# EAGLE design M218X (EAGLE 6.6.0)
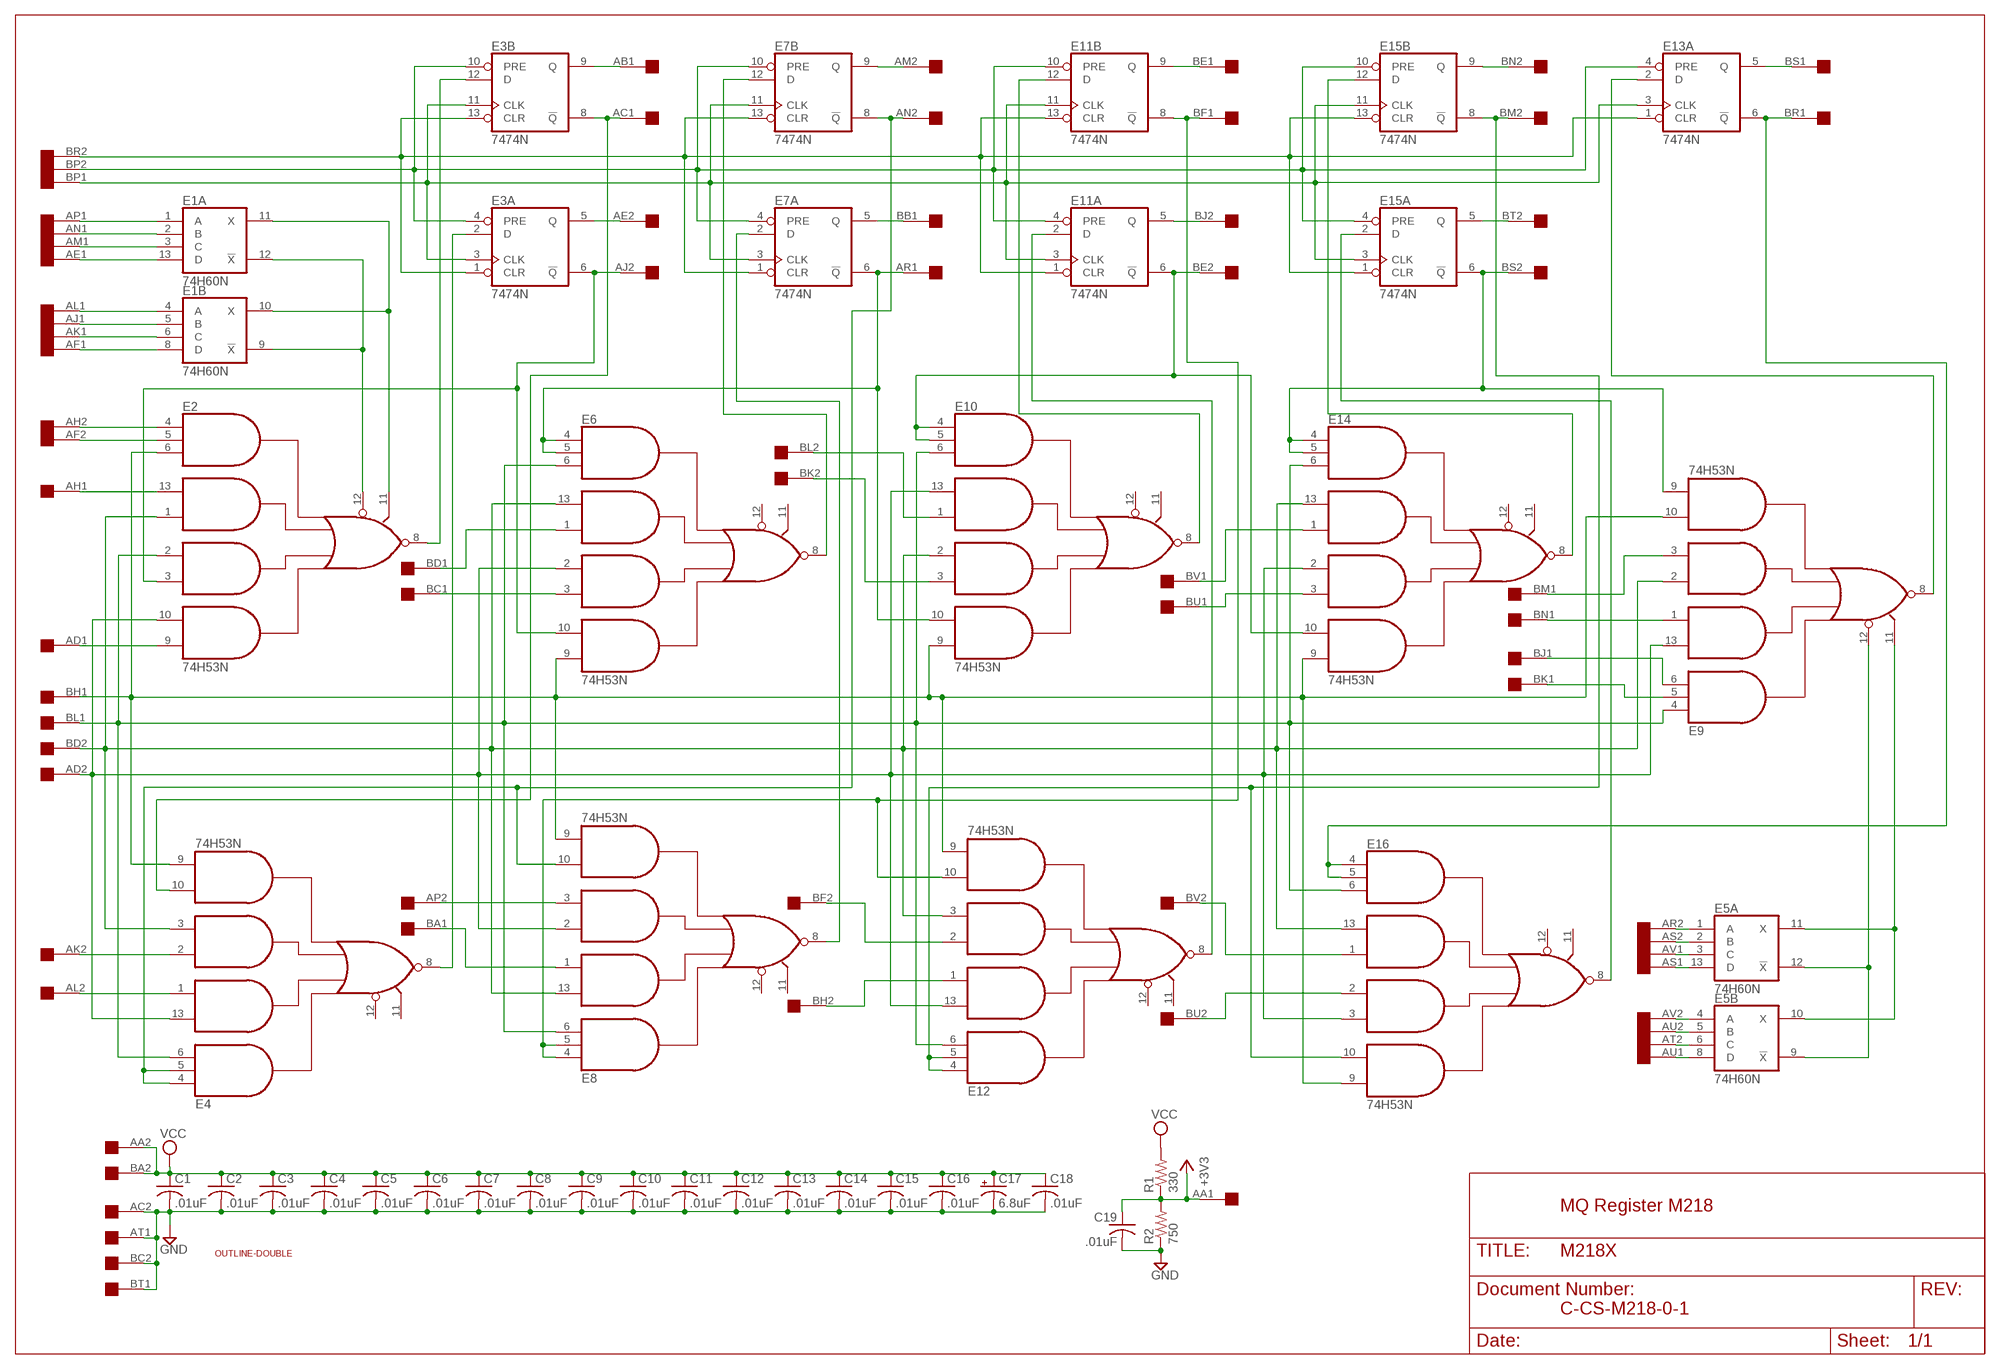
[diagram p0: schematic, sheet 1]

## Parts
C1  .01uF  C-US050-025X075  [C050-025X075]
C2  .01uF  C-US050-025X075  [C050-025X075]
C3  .01uF  C-US050-025X075  [C050-025X075]
C4  .01uF  C-US050-025X075  [C050-025X075]
C5  .01uF  C-US050-025X075  [C050-025X075]
C6  .01uF  C-US050-025X075  [C050-025X075]
C7  .01uF  C-US050-025X075  [C050-025X075]
C8  .01uF  C-US050-025X075  [C050-025X075]
C9  .01uF  C-US050-025X075  [C050-025X075]
C10  .01uF  C-US050-025X075  [C050-025X075]
C11  .01uF  C-US050-025X075  [C050-025X075]
C12  .01uF  C-US050-025X075  [C050-025X075]
C13  .01uF  C-US050-025X075  [C050-025X075]
C14  .01uF  C-US050-025X075  [C050-025X075]
C15  .01uF  C-US050-025X075  [C050-025X075]
C16  .01uF  C-US050-025X075  [C050-025X075]
C17  6.8uF  CPOL-USE20-8AXIAL  [E12-8]
C18  .01uF  C-US050-025X075  [C050-025X075]
C19  .01uF  C-US050-025X075  [C050-025X075]
E1  74H60N  7460N  [DIL14]
E2  74H53N  [DIL14]
E3  7474N  74S74N  [DIL14]
E4  74H53N  [DIL14]
E5  74H60N  7460N  [DIL14]
E6  74H53N  [DIL14]
E7  7474N  74S74N  [DIL14]
E8  74H53N  [DIL14]
E9  74H53N  [DIL14]
E10  74H53N  [DIL14]
E11  7474N  74S74N  [DIL14]
E12  74H53N  [DIL14]
E13  7474N  74S74N  [DIL14]
E14  74H53N  [DIL14]
E15  7474N  74S74N  [DIL14]
E16  74H53N  [DIL14]
R1  330  R-US_0207/10  [0207/10]
R2  750  R-US_0207/10  [0207/10]
U$1  OUTLINE-DOUBLE  [DOUBLE]
U$3  DOUBLE  [EDGE-CON4]

## Nets
+3V3 [supply]: C19.1 R1.1 R2.2 U$3.AA1
GND [supply]: C1.2 C2.2 C3.2 C4.2 C5.2 C6.2 C7.2 C8.2 C9.2 C10.2 C11.2 C12.2 C13.2 C14.2 C15.2 C16.2 C17.- C18.2 C19.2 R2.1 U$3.AC2 U$3.AT1 U$3.BC2 U$3.BT1
N$1: E1.9(B:!X) E1.12(A:!X) E2.12(I9)
N$2: E1.10(B:X) E1.11(A:X) E2.11(I10)
N$3: E1.1(A:A) U$3.AP1
N$4: E1.3(A:C) U$3.AM1
N$5: E1.2(A:B) U$3.AN1
N$6: E1.13(A:D) U$3.AE1
N$7: E1.4(B:A) U$3.AL1
N$8: E1.5(B:B) U$3.AJ1
N$9: E1.6(B:C) U$3.AK1
N$10: E1.8(B:D) U$3.AF1
N$11: E2.4(I1) U$3.AH2
N$12: E2.5(I11) U$3.AF2
N$13: E2.6(I2) E4.9(I8) E6.9(I8) E8.9(I8) E9.10(I7) E10.9(I8) E12.9(I8) E14.9(I8) E16.9(I8) U$3.BH1
N$14: E2.13(I3) U$3.AH1
N$15: E2.1(I4) E4.3(I6) E6.13(I3) E8.13(I3) E9.2(I5) E10.2(I5) E12.3(I6) E14.13(I3) E16.13(I3) U$3.BD2
N$16: E2.2(I5) E4.6(I2) E6.6(I2) E8.6(I2) E9.4(I1) E10.6(I2) E12.6(I2) E14.6(I2) E16.6(I2) U$3.BL1
N$17: E2.3(I6) E3.6(A:!Q) E6.10(I7) U$3.AJ2
N$18: E2.9(I8) U$3.AD1
N$19: E2.10(I7) E4.13(I3) E6.2(I5) E8.2(I5) E9.13(I3) E10.13(I3) E12.13(I3) E14.2(I5) E16.3(I6) U$3.AD2
N$20: E3.8(B:!Q) E4.10(I7) U$3.AC1
N$21: E4.1(I4) U$3.AL2
N$22: E4.2(I5) U$3.AK2
N$23: E4.4(I1) E4.5(I11) E7.8(B:!Q) E8.10(I7) U$3.AN2
N$24: E3.1(A:CLR) E3.13(B:CLR) E7.1(A:CLR) E7.13(B:CLR) E11.1(A:CLR) E11.13(B:CLR) E13.1(A:CLR) E15.1(A:CLR) E15.13(B:CLR) U$3.BR2
N$25: E3.2(A:D) E4.8(O)
N$26: E3.4(A:PRE) E3.10(B:PRE) E7.4(A:PRE) E7.10(B:PRE) E11.4(A:PRE) E11.10(B:PRE) E13.4(A:PRE) E15.4(A:PRE) E15.10(B:PRE) U$3.BP2
N$27: E3.3(A:CLK) E3.11(B:CLK) E7.3(A:CLK) E7.11(B:CLK) E11.3(A:CLK) E11.11(B:CLK) E13.3(A:CLK) E15.3(A:CLK) E15.11(B:CLK) U$3.BP1
N$28: E2.8(O) E3.12(B:D)
N$29: E8.3(I6) U$3.AP2
N$30: E3.9(B:Q) U$3.AB1
N$31: E3.5(A:Q) U$3.AE2
N$32: E6.4(I1) E6.5(I11) E7.6(A:!Q) E10.10(I7) U$3.AR1
N$33: E6.3(I6) U$3.BC1
N$34: E6.1(I4) U$3.BD1
N$35: E8.4(I1) E8.5(I11) E11.8(B:!Q) E12.10(I7) U$3.BF1
N$36: E8.1(I4) U$3.BA1
N$37: E6.8(O) E7.12(B:D)
N$38: E7.2(A:D) E8.8(O)
N$39: E10.4(I1) E10.5(I11) E11.6(A:!Q) E14.10(I7) U$3.BE2
N$40: E7.9(B:Q) U$3.AM2
N$41: E7.5(A:Q) U$3.BB1
N$42: E9.8(O) E13.2(A:D)
N$43: E9.9(I8) E14.4(I1) E14.5(I11) E15.6(A:!Q) U$3.BS2
N$44: E11.9(B:Q) U$3.BE1
N$46: E11.5(A:Q) U$3.BJ2
N$47: E12.4(I1) E12.5(I11) E15.8(B:!Q) E16.10(I7) U$3.BM2
N$48: E15.9(B:Q) U$3.BN2
N$50: E15.5(A:Q) U$3.BT2
N$51: E13.6(A:!Q) E16.4(I1) E16.5(I11) U$3.BR1
N$52: E13.5(A:Q) U$3.BS1
N$53: E5.1(A:A) U$3.AR2
N$54: E5.2(A:B) U$3.AS2
N$55: E5.3(A:C) U$3.AV1
N$56: E5.13(A:D) U$3.AS1
N$57: E5.4(B:A) U$3.AV2
N$58: E5.5(B:B) U$3.AU2
N$59: E5.6(B:C) U$3.AT2
N$60: E5.8(B:D) U$3.AU1
N$61: E5.10(B:X) E5.11(A:X) E9.11(I10)
N$62: E5.9(B:!X) E5.12(A:!X) E9.12(I9)
N$63: E10.8(O) E11.12(B:D)
N$64: E11.2(A:D) E12.8(O)
N$65: E10.1(I4) U$3.BL2
N$66: E10.3(I6) U$3.BK2
N$67: E12.1(I4) U$3.BH2
N$68: E12.2(I5) U$3.BF2
N$70: E9.6(I2) U$3.BJ1
N$72: E14.8(O) E15.12(B:D)
N$73: E15.2(A:D) E16.8(O)
N$74: E14.3(I6) U$3.BU1
N$75: E14.1(I4) U$3.BV1
N$76: E16.1(I4) U$3.BV2
N$77: E16.2(I5) U$3.BU2
N$79: E9.5(I11) U$3.BK1
N$80: E9.3(I6) U$3.BM1
N$81: E9.1(I4) U$3.BN1
VCC [supply]: C1.1 C2.1 C3.1 C4.1 C5.1 C6.1 C7.1 C8.1 C9.1 C10.1 C11.1 C12.1 C13.1 C14.1 C15.1 C16.1 C17.+ C18.1 R1.2 U$3.AA2 U$3.BA2
Unconnected: E4.11(I10) E4.12(I9) E6.11(I10) E6.12(I9) E8.11(I10) E8.12(I9) E10.11(I10) E10.12(I9) E12.11(I10) E12.12(I9) E13.8(B:!Q) E13.9(B:Q) E13.10(B:PRE) E13.11(B:CLK) E13.12(B:D) E13.13(B:CLR) E14.11(I10) E14.12(I9) E16.11(I10) E16.12(I9) U$3.AB2 U$3.BB2

## Notes on the sheet
- MQ Register M218
- C-CS-M218-0-1

## Power pins joined to a net without a drawn wire
GND: E1.7(P:GND) E2.7(GND) E3.7(P:GND) E4.7(GND) E5.7(P:GND) E6.7(GND) E7.7(P:GND) E8.7(GND) E9.7(GND) E10.7(GND) E11.7(P:GND) E12.7(GND) E13.7(P:GND) E14.7(GND) E15.7(P:GND) E16.7(GND)
VCC: E1.14(P:VCC) E2.14(VCC) E3.14(P:VCC) E4.14(VCC) E5.14(P:VCC) E6.14(VCC) E7.14(P:VCC) E8.14(VCC) E9.14(VCC) E10.14(VCC) E11.14(P:VCC) E12.14(VCC) E13.14(P:VCC) E14.14(VCC) E15.14(P:VCC) E16.14(VCC)

## Library data of the parts
C1-C16 C18 C19 = rcl:C-US: CAPACITOR, American symbol
C17 = dec-con:CPOL-USE20-8AXIAL: A 0.8 inch electrolytic.
E1 E5 = 74xx-us:74*60: Dual 4-input EXPANDER
E2 E4 E6 E8-E10 E12 E14 E16 = dec-con:74H53N: 2-2-2-3 Input And-Or-Invert Gate
E3 E7 E11 E13 E15 = 74xx-us:74*74: Dual D type positive edge triggered FLIP FLOP, preset and clear
R1 R2 = rcl:R-US_: RESISTOR, American symbol
U$1 = dec-con:OUTLINE-*: Board outlines for DEC boards.
U$3 = dec-con:DOUBLE: Double-Height DEC board

## Net classes
1 supply: width 0.813 mm

## Board
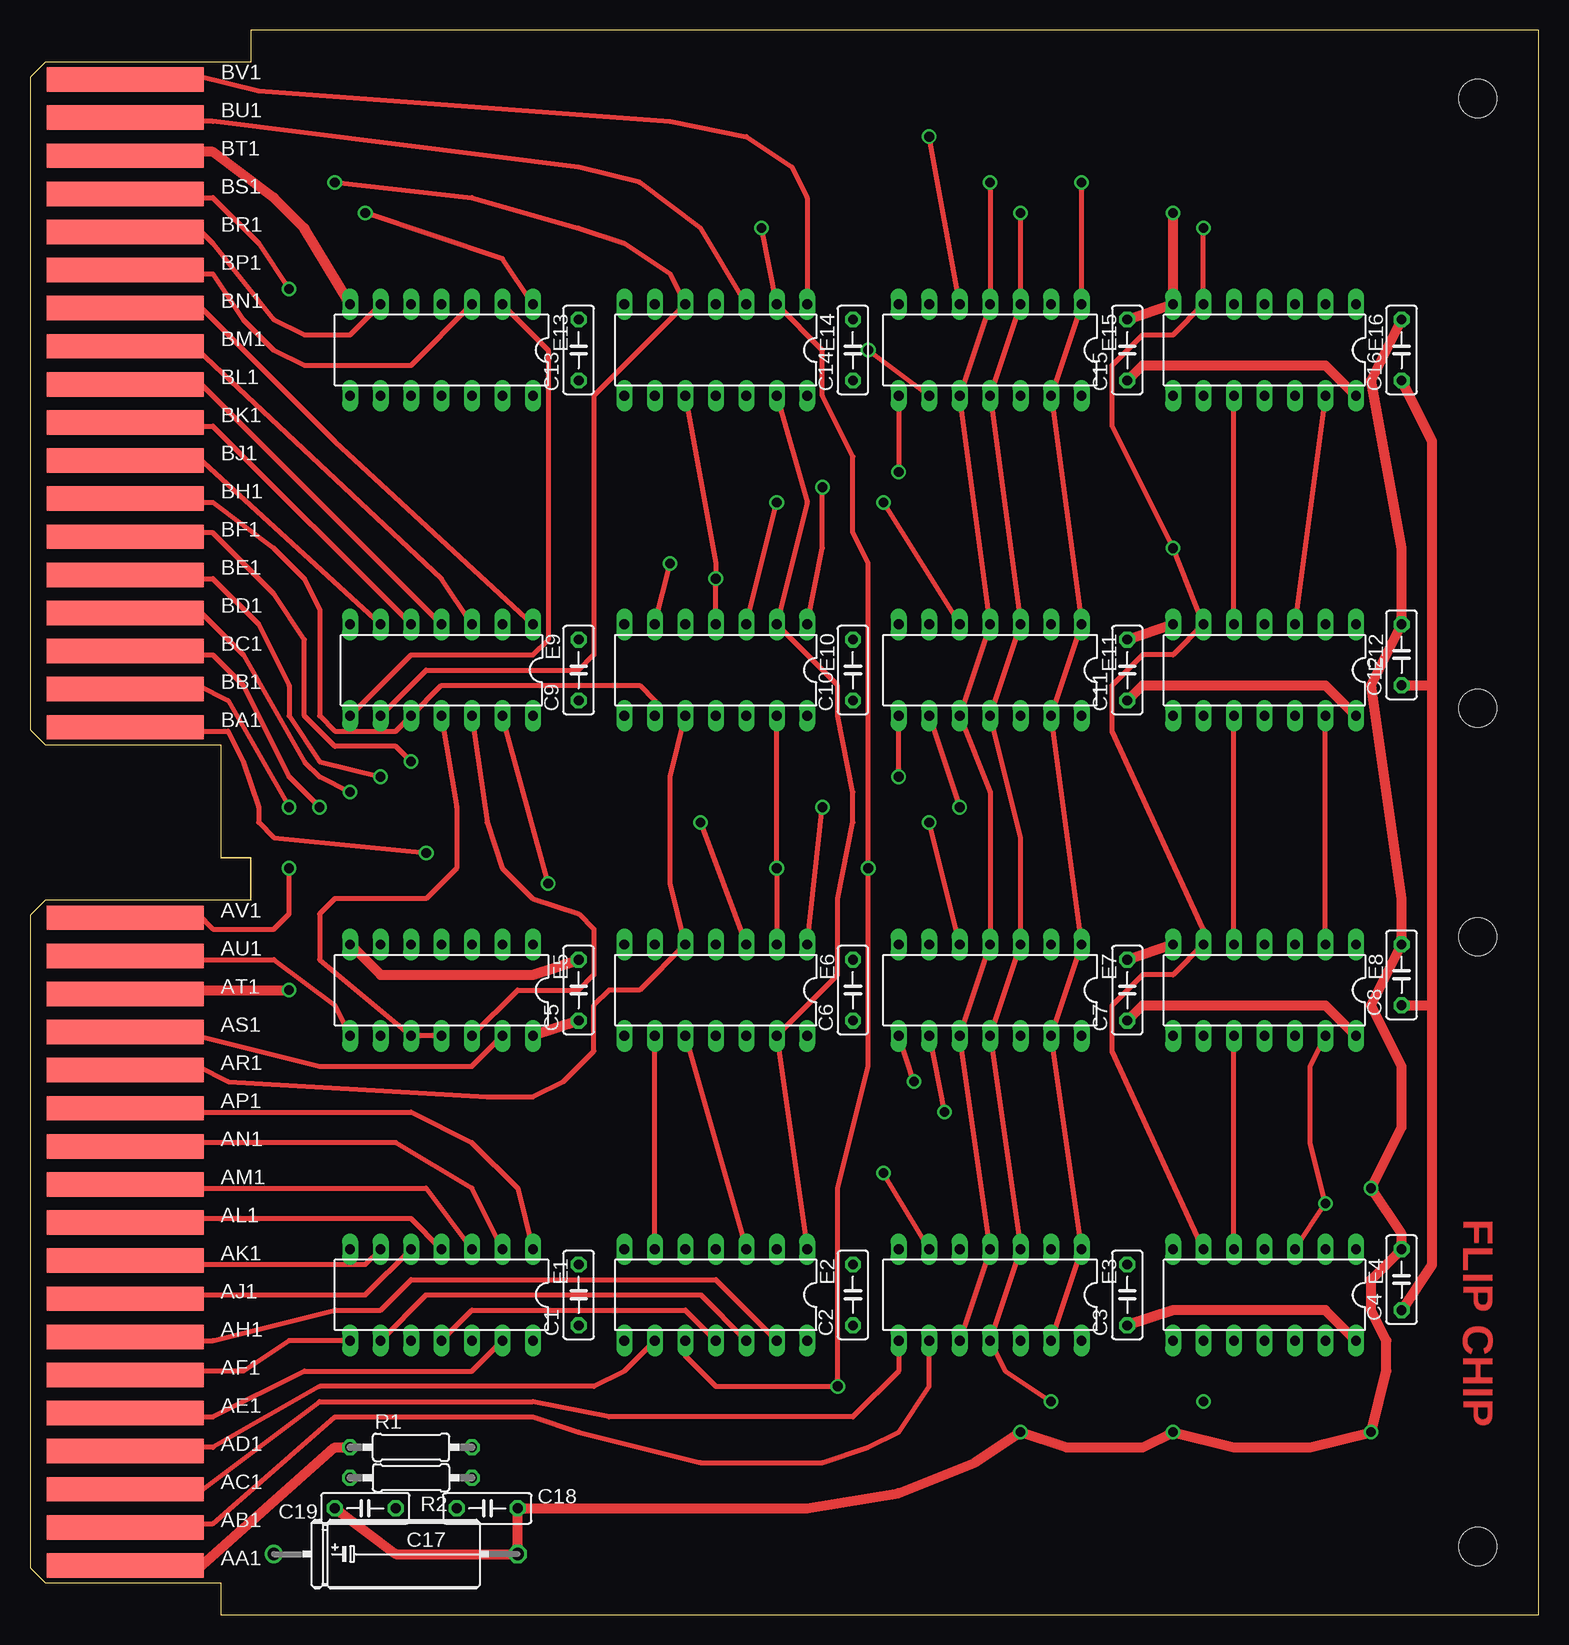
[diagram p1: board, top side]
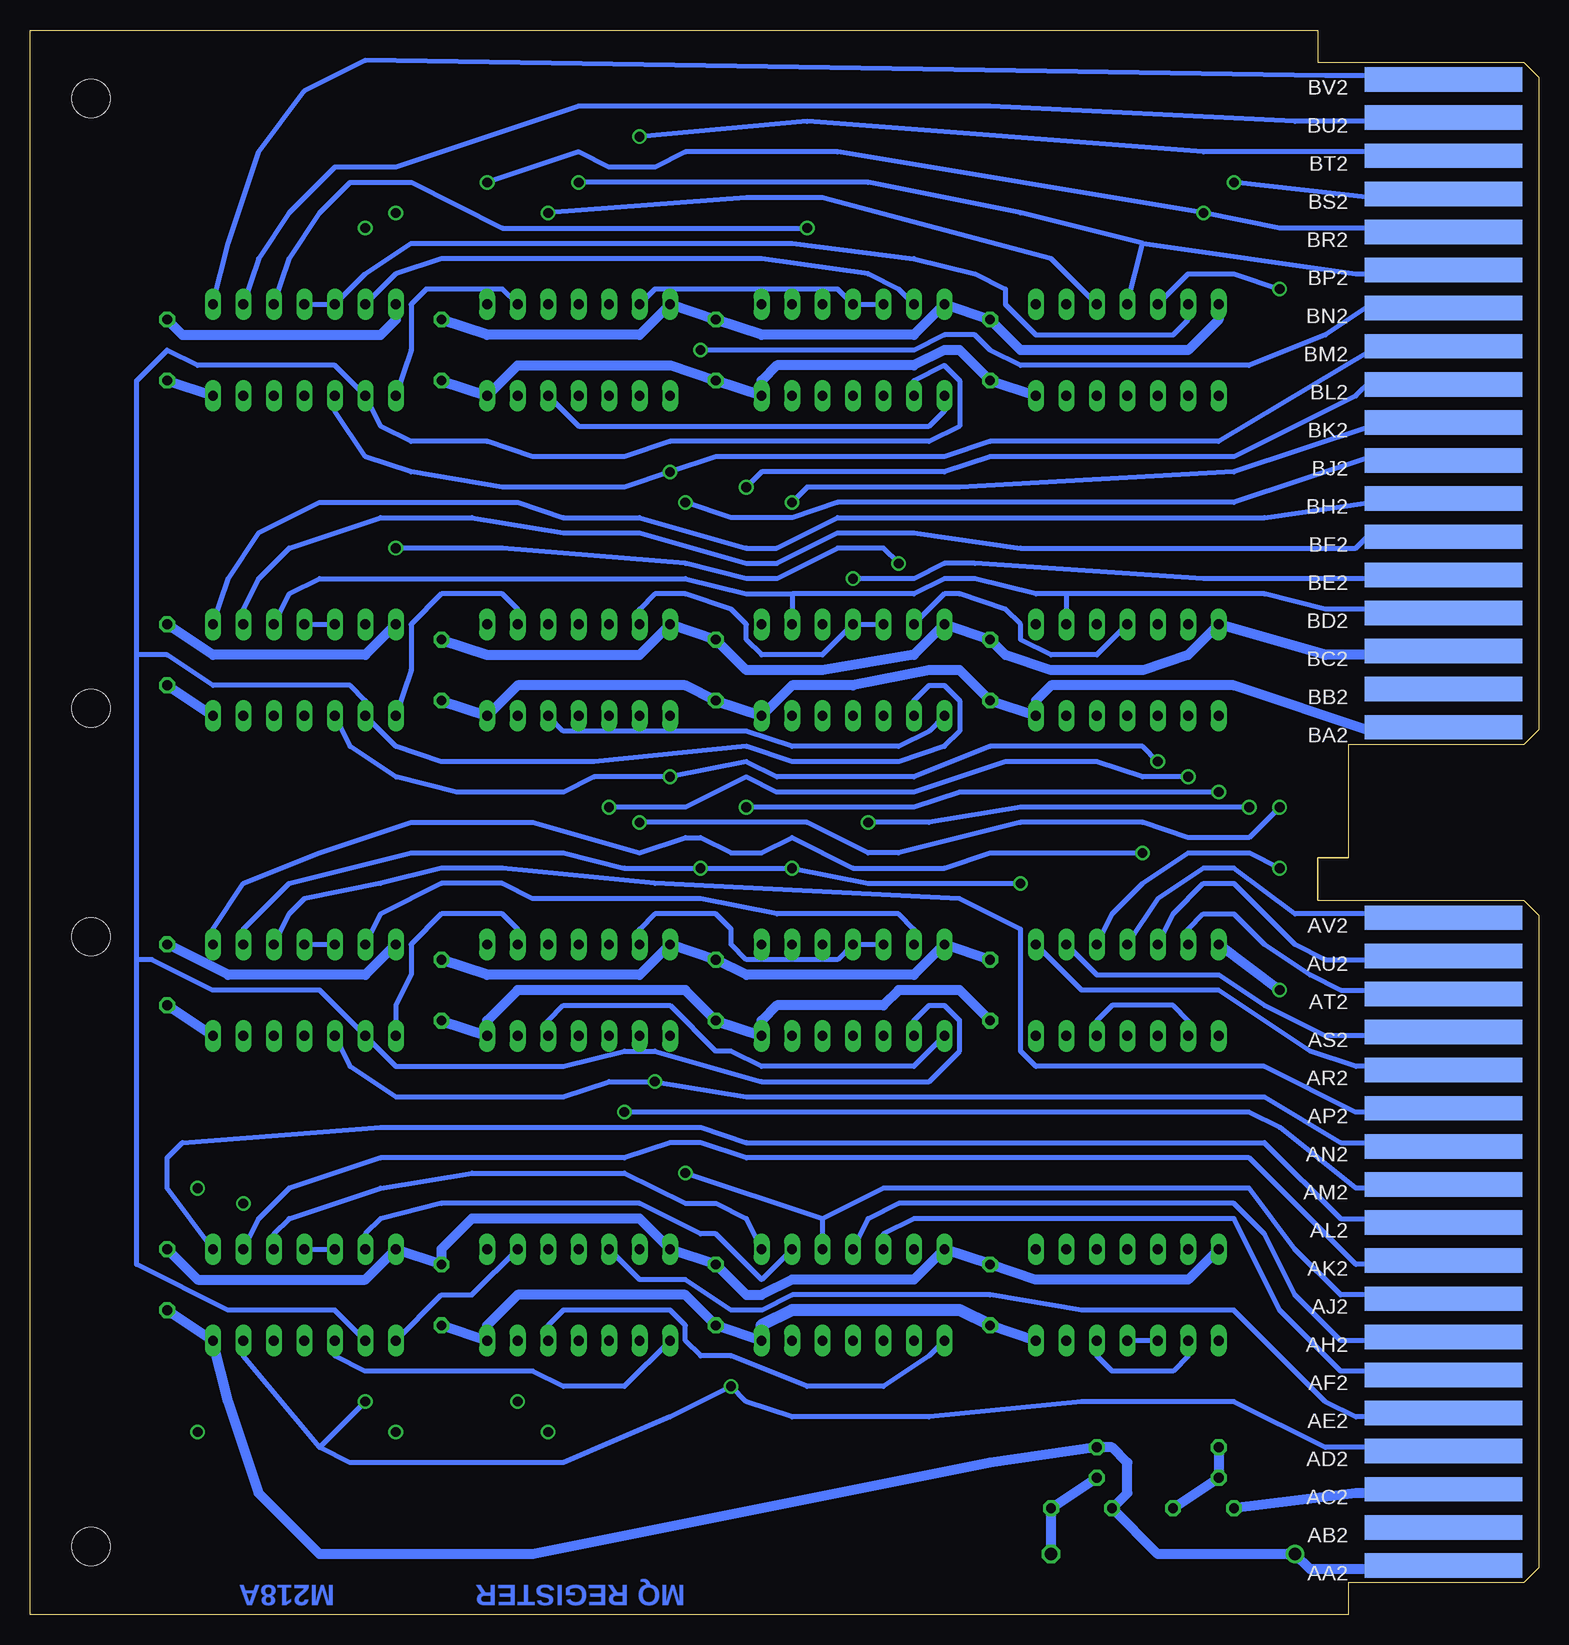
[diagram p2: board, bottom side, seen from below]

Size 125.73 x 132.08 mm. Coordinates in mm from the lower left corner, seen from the top.
Copper layers (1+16): Top 0.035mm / dielectric 1.5mm / Bottom 0.035mm
Design rules "16mils": minimum track width 16mil, minimum drill 32mil, track to track 15mil, track to pad 10mil, pad to pad 10mil, via to via 10mil, smd to smd 10mil, copper to edge 13mil, drill to drill 10mil, minimum pad ring 10mil, minimum via ring 8mil, stop-mask expansion 0mil, vias tented up to drill 0mil, thermal gap 10mil

### Footprints (pad centres in the part's own frame; a part is rotated, then mirrored left to right if it is on the bottom)
C050-025X075 = drill 0.813 octagon: 1 -2.54,0; 2 2.54,0
E12-8 = drill 1.016: + -10.16,0 | drill 1.016 octagon: - 10.16,0
DIL14 = drill 0.813 long: 1 -7.62,-3.81; 2 -5.08,-3.81; 3 -2.54,-3.81; 4 0,-3.81; 5 2.54,-3.81; 6 5.08,-3.81; 7 7.62,-3.81; 8 7.62,3.81; 9 5.08,3.81; 10 2.54,3.81; 11 0,3.81; 12 -2.54,3.81; 13 -5.08,3.81; 14 -7.62,3.81
0207/10 = drill 0.813 octagon: 1 -5.08,0; 2 5.08,0
DOUBLE = hole 3.175: 120.65,56.515; 120.65,5.715; 120.65,75.565; 120.65,126.365
EDGE-CON4 = smd 13.106 x 2.032: AA1 7.938,4.128; AB1 7.938,7.303; AC1 7.938,10.477; AD1 7.938,13.652; AE1 7.938,16.828; AF1 7.938,20.003; AH1 7.938,23.177; AJ1 7.938,26.352; AK1 7.938,29.527; AL1 7.938,32.703; AM1 7.938,35.877; AN1 7.938,39.053; AP1 7.938,42.227; AR1 7.938,45.403; AS1 7.938,48.578; AT1 7.938,51.752; AU1 7.938,54.928; AV1 7.938,58.102; BA1 7.938,73.978; BB1 7.938,77.153; BC1 7.938,80.328; BD1 7.938,83.502; BE1 7.938,86.677; BF1 7.938,89.853; BH1 7.938,93.028; BJ1 7.938,96.203; BK1 7.938,99.377; BL1 7.938,102.552; BM1 7.938,105.728; BN1 7.938,108.903; BP1 7.938,112.078; BR1 7.938,115.252; BS1 7.938,118.427; BT1 7.938,121.603; BU1 7.938,124.778; BV1 7.938,127.953 | smd 13.106 x 2.032 bottom: AA2 7.938,4.128; AB2 7.938,7.303; AC2 7.938,10.477; AD2 7.938,13.652; AE2 7.938,16.828; AF2 7.938,20.003; AH2 7.938,23.177; AJ2 7.938,26.352; AK2 7.938,29.527; AL2 7.938,32.703; AM2 7.938,35.877; AN2 7.938,39.053; AP2 7.938,42.227; AR2 7.938,45.403; AS2 7.938,48.578; AT2 7.938,51.752; AU2 7.938,54.928; AV2 7.938,58.102; BA2 7.938,73.978; BB2 7.938,77.153; BC2 7.938,80.328; BD2 7.938,83.502; BE2 7.938,86.677; BF2 7.938,89.853; BH2 7.938,93.028; BJ2 7.938,96.203; BK2 7.938,99.377; BL2 7.938,102.552; BM2 7.938,105.728; BN2 7.938,108.903; BP2 7.938,112.078; BR2 7.938,115.252; BS2 7.938,118.427; BT2 7.938,121.603; BU2 7.938,124.778; BV2 7.938,127.953

### Placement (x,y rotation side)
C1  45.72,26.67 90 top
C2  68.58,26.67 90 top
C3  91.44,26.67 90 top
C4  114.3,27.94 90 top
C5  45.72,52.07 90 top
C6  68.58,52.07 90 top
C7  91.44,52.07 90 top
C8  114.3,53.34 90 top
C9  45.72,78.74 90 top
C10  68.58,78.74 90 top
C11  91.44,78.74 90 top
C12  114.3,80.01 90 top
C13  45.72,105.41 90 top
C14  68.58,105.41 90 top
C15  91.44,105.41 90 top
C16  114.3,105.41 90 top
C17  30.48,5.08 0 top
C18  38.1,8.89 0 top
C19  27.94,8.89 180 top
E1  34.29,26.67 180 top
E2  57.15,26.67 180 top
E3  80.01,26.67 180 top
E4  102.87,26.67 180 top
E5  34.29,52.07 180 top
E6  57.15,52.07 180 top
E7  80.01,52.07 180 top
E8  102.87,52.07 180 top
E9  34.29,78.74 180 top
E10  57.15,78.74 180 top
E11  80.01,78.74 180 top
E12  102.87,78.74 180 top
E13  34.29,105.41 180 top
E14  57.15,105.41 180 top
E15  80.01,105.41 180 top
E16  102.87,105.41 180 top
R1  31.75,13.97 0 top
R2  31.75,11.43 180 top
U$1  0,0 0 top
U$3  0,0 0 top

### Tracks (layer width: path | path; a pad name or v marks a point on that pad's centre or on a via)
+3V3
  Top 0.813: U$3.AA1 8.89,3.81 13.97,3.81 25.4,13.97 R1.1
  Bottom 0.813: R1.1 R2.2 C19.1
GND  (via drill 0.81)
  Top 0.813: C7.2 E8.7 | C11.2 E12.7 | C16.2 111.76,102.87 114.3,88.9 C12.2 111.76,77.47 114.3,59.69 C8.2 111.76,50.8 114.3,45.72 114.3,40.64 v111.76,35.56 114.3,31.75 C4.2 111.76,27.94 111.76,25.4 113.03,22.86 113.03,20.32 v111.76,15.24 106.68,13.97 100.33,13.97 v95.25,15.24 92.71,13.97 86.36,13.97 v82.55,15.24 78.74,12.7 72.39,10.16 64.77,8.89 C18.2 C17.- 30.48,5.08 C19.2 | C15.2 E16.7 v95.25,116.84 | E13.7 22.86,115.57 20.32,118.11 15.24,121.92 8.89,121.92 U$3.BT1 | U$3.AT1 8.89,52.07 v21.59,52.07 | E5.7 29.21,53.34 41.91,53.34 C5.2
  Bottom 0.813: C17.- C18.2 R2.1 | U$3.AC2 10.16,10.16 15.24,10.16 C19.2 | C4.2 111.76,27.94 97.79,27.94 E4.7 C3.2 91.44,30.48 88.9,33.02 74.93,33.02 E3.7 C2.2 66.04,26.67 64.77,26.67 62.23,27.94 52.07,27.94 E2.7 C1.2 41.91,27.94 29.21,27.94 E1.7 | E5.7 v21.59,52.07 | E8.7 97.79,53.34 109.22,53.34 C8.2 | C7.2 87.63,53.34 74.93,53.34 E7.7 C6.2 66.04,53.34 52.07,53.34 E6.7 C5.2 | C11.2 87.63,80.01 74.93,80.01 E11.7 C10.2 66.04,78.74 59.69,78.74 52.07,80.01 E10.7 C9.2 44.45,80.01 40.64,78.74 33.02,78.74 29.21,80.01 E9.7 17.78,80.01 10.16,80.01 U$3.BC2 | E12.7 97.79,80.01 110.49,80.01 C12.2 | C15.2 87.63,106.68 74.93,106.68 E15.7 C14.2 64.77,106.68 52.07,106.68 E14.7 C13.2 43.18,105.41 29.21,105.41 26.67,107.95 E13.7 | C16.2 113.03,106.68 96.52,106.68 95.25,107.95 E16.7
N$1
  Top 0.406: E1.9 33.02,26.67 55.88,26.67 E2.12
  Bottom 0.406: E1.9 29.21,21.59 30.48,20.32 35.56,20.32 36.83,21.59 E1.12
N$2
  Top 0.406: E1.11 36.83,25.4 54.61,25.4 E2.11
  Bottom 0.406: E1.10 E1.11
N$3
  Top 0.406: U$3.AP1 8.89,41.91 31.75,41.91 36.83,39.37 40.64,35.56 E1.1
N$4
  Top 0.406: U$3.AM1 8.89,35.56 33.02,35.56 E1.3
N$5
  Top 0.406: E1.2 36.83,35.56 30.48,39.37 8.89,39.37 U$3.AN1
N$6
  Top 0.406: U$3.AE1 8.89,16.51 15.24,16.51 22.86,20.32 36.83,20.32 E1.13
N$7
  Top 0.406: E1.4 31.75,33.02 8.89,33.02 U$3.AL1
N$8
  Top 0.406: U$3.AJ1 8.89,26.67 27.94,26.67 E1.5
N$9
  Top 0.406: U$3.AK1 8.89,29.21 27.94,29.21 E1.6
N$10
  Top 0.406: E1.8 21.59,22.86 17.78,20.32 8.89,20.32 U$3.AF1
N$11
  Bottom 0.406: U$3.AH2 10.16,22.86 16.51,22.86 20.32,26.67 22.86,31.75 25.4,34.29 53.34,34.29 55.88,33.02 E2.4
N$12
  Bottom 0.406: U$3.AF2 10.16,20.32 16.51,20.32 21.59,25.4 25.4,33.02 52.07,33.02 54.61,31.75 E2.5
N$13
  Top 0.406: E2.6 E6.9 | U$3.BH1 8.89,92.71 15.24,92.71 20.32,88.9 22.86,86.36 24.13,83.82 24.13,74.93 25.4,73.66 30.48,73.66 E9.10 34.29,77.47 50.8,77.47 52.07,76.2 E10.9
  Bottom 0.406: E4.9 100.33,25.4 109.22,25.4 116.84,29.21 116.84,54.61 | E6.9 52.07,49.53 50.8,50.8 49.53,50.8 48.26,49.53 48.26,46.99 50.8,44.45 64.77,44.45 73.66,46.99 76.2,46.99 81.28,45.72 95.25,45.72 E8.9 101.6,52.07 110.49,52.07 115.57,54.61 116.84,54.61 | E10.9 52.07,76.2 50.8,77.47 49.53,77.47 48.26,76.2 48.26,73.66 49.53,72.39 53.34,71.12 62.23,71.12 66.04,72.39 78.74,71.12 91.44,71.12 95.25,72.39 E12.9 97.79,76.2 99.06,77.47 110.49,77.47 114.3,80.01 116.84,80.01 | E14.9 52.07,102.87 49.53,104.14 48.26,102.87 48.26,99.06 50.8,97.79 72.39,97.79 76.2,96.52 83.82,96.52 87.63,97.79 93.98,97.79 96.52,99.06 E16.9 100.33,104.14 111.76,104.14 114.3,105.41 116.84,102.87 116.84,80.01 | 116.84,54.61 116.84,80.01
N$14
  Top 0.406: U$3.AH1 8.89,22.86 15.24,22.86 25.4,25.4 29.21,25.4 31.75,27.94 57.15,27.94 E2.13
N$15  (via drill 0.81)
  Top 0.406: E4.3 v107.95,34.29 106.68,39.37 106.68,45.72 E8.13 | E16.13 E12.3 | E14.13 64.77,92.71 E10.2 67.31,77.47 67.31,74.93 68.58,68.58 68.58,66.04 67.31,59.69 67.31,53.34 E6.13 E2.1
  Bottom 0.406: E4.3 105.41,31.75 104.14,33.02 96.52,35.56 88.9,36.83 76.2,36.83 71.12,34.29 68.58,34.29 66.04,33.02 E2.1 | U$3.BD2 10.16,83.82 17.78,83.82 22.86,85.09 39.37,85.09 | 39.37,85.09 E9.2 | 39.37,85.09 41.91,85.09 46.99,86.36 49.53,86.36 52.07,85.09 62.23,85.09 | 62.23,85.09 E10.2 | E12.3 104.14,85.09 101.6,86.36 71.12,86.36 66.04,85.09 62.23,85.09
N$16  (via drill 0.81)
  Top 0.406: E4.6 90.17,46.99 90.17,50.8 92.71,53.34 95.25,53.34 E8.6 97.79,57.15 90.17,73.66 90.17,77.47 92.71,80.01 95.25,80.01 E12.6 v95.25,88.9 90.17,99.06 90.17,104.14 92.71,106.68 95.25,106.68 E16.6 v97.79,115.57 | E10.6 v53.34,87.63 | U$3.BL1 8.89,102.87 13.97,102.87 E9.4
  Bottom 0.406: E2.2 64.77,27.94 68.58,31.75 69.85,31.75 74.93,34.29 91.44,34.29 96.52,33.02 97.79,31.75 E4.6 | E6.6 52.07,57.15 53.34,58.42 63.5,58.42 69.85,59.69 83.82,59.69 86.36,60.96 91.44,60.96 96.52,58.42 E8.6 | E9.4 36.83,80.01 40.64,80.01 43.18,81.28 43.18,82.55 44.45,83.82 48.26,85.09 49.53,85.09 E10.6 | E14.6 53.34,110.49 55.88,111.76 64.77,113.03 91.44,113.03 95.25,111.76 E16.6 | v53.34,87.63 54.61,88.9 58.42,88.9 63.5,86.36 66.04,86.36 71.12,87.63 86.36,88.9 v95.25,88.9
N$17  (via drill 0.81)
  Top 0.406: E3.6 v71.12,36.83 | E6.10 E2.3
  Bottom 0.406: U$3.AJ2 10.16,26.67 16.51,26.67 20.32,30.48 24.13,35.56 54.61,35.56 59.69,33.02 | 59.69,33.02 E2.3 | 59.69,33.02 v71.12,36.83
N$18
  Top 0.406: E2.9 49.53,20.32 46.99,19.05 24.13,19.05 15.24,13.97 8.89,13.97 U$3.AD1
N$19  (via drill 0.81)
  Top 0.406: E8.2 E12.13 | v60.96,115.57 E14.2 66.04,105.41 66.04,101.6 68.58,96.52 68.58,90.17 69.85,87.63 v69.85,62.23 69.85,45.72 67.31,35.56 v67.31,19.05 57.15,19.05 54.61,21.59 E2.10 | E6.2 v62.23,62.23 E10.13 | v43.18,60.96 E9.13
  Bottom 0.406: U$3.AD2 10.16,13.97 17.78,13.97 25.4,17.78 38.1,17.78 50.8,16.51 62.23,16.51 66.04,17.78 v67.31,19.05 72.39,16.51 81.28,12.7 99.06,12.7 101.6,13.97 | 101.6,13.97 107.95,21.59 E4.13 | 101.6,13.97 v97.79,17.78 | E8.2 107.95,57.15 104.14,60.96 93.98,63.5 81.28,63.5 76.2,62.23 v69.85,62.23 v62.23,62.23 55.88,60.96 v43.18,60.96 | E16.3 104.14,113.03 101.6,116.84 99.06,119.38 93.98,119.38 86.36,115.57 v60.96,115.57
N$20
  Top 0.406: U$3.AC1 8.89,10.16 13.97,10.16 24.13,17.78 41.91,17.78 48.26,16.51 68.58,16.51 72.39,20.32 E3.8
  Bottom 0.406: E3.8 76.2,19.05 81.28,19.05 83.82,20.32 97.79,20.32 100.33,21.59 E4.10
N$21
  Bottom 0.406: E4.1 114.3,35.56 114.3,38.1 113.03,39.37 96.52,40.64 69.85,40.64 66.04,39.37 22.86,39.37 16.51,33.02 8.89,33.02 U$3.AL2
N$22
  Bottom 0.406: U$3.AK2 12.7,29.21 15.24,29.21 24.13,38.1 66.04,38.1 69.85,39.37 72.39,39.37 76.2,38.1 96.52,38.1 104.14,35.56 106.68,33.02 E4.2
N$23  (via drill 0.81)
  Top 0.406: E4.5 E8.10 | v73.66,44.45 E7.8
  Bottom 0.406: E8.10 99.06,45.72 95.25,43.18 81.28,43.18 77.47,44.45 v73.66,44.45 66.04,43.18 22.86,43.18 16.51,39.37 8.89,39.37 U$3.AN2 | E4.4 E4.5
N$24  (via drill 0.81)
  Top 0.406: E3.13 E3.1 E7.13 E7.1 E11.13 E11.1 E15.13 E15.1 v87.63,119.38 | E13.1 39.37,113.03 v27.94,116.84
  Bottom 0.406: U$3.BR2 11.43,115.57 21.59,115.57 v27.94,116.84 58.42,121.92 71.12,121.92 73.66,120.65 77.47,120.65 80.01,121.92 v87.63,119.38
N$25
  Bottom 0.406: E3.2 88.9,26.67 91.44,26.67 E4.8
N$26  (via drill 0.81)
  Top 0.406: E3.10 E3.4 E7.10 E7.4 80.01,68.58 E11.10 E11.4 E15.10 E15.4 v80.01,119.38
  Bottom 0.406: E13.4 33.02,114.3 | 33.02,114.3 15.24,111.76 8.89,111.76 U$3.BP2 | 33.02,114.3 43.18,116.84 55.88,119.38 v80.01,119.38
N$27  (via drill 0.81)
  Top 0.406: v85.09,17.78 81.28,20.32 E3.11 E3.3 E7.11 E7.3 82.55,64.77 E11.11 E11.3 E15.11 E15.3 v82.55,116.84 | U$3.BP1 8.89,111.76 15.24,111.76 17.78,107.95 20.32,105.41 22.86,104.14 31.75,104.14 E13.3
  Bottom 0.406: E13.3 40.64,113.03 59.69,118.11 66.04,118.11 v82.55,116.84
N$28
  Bottom 0.406: E2.8 50.8,21.59 54.61,19.05 60.96,19.05 67.31,21.59 69.85,21.59 71.12,22.86 71.12,24.13 72.39,25.4 81.28,25.4 82.55,24.13 E3.12
N$29
  Bottom 0.406: U$3.AP2 10.16,41.91 15.24,41.91 22.86,45.72 41.91,45.72 43.18,46.99 43.18,57.15 48.26,59.69 73.66,60.96 86.36,62.23 91.44,62.23 96.52,60.96 102.87,59.69 104.14,58.42 E8.3
N$30
  Top 0.406: U$3.AB1 8.89,7.62 15.24,7.62 25.4,16.51 41.91,16.51 45.72,15.24 55.88,12.7 66.04,12.7 69.85,13.97 72.39,15.24 74.93,19.05 E3.9
N$31
  Bottom 0.406: U$3.AE2 10.16,16.51 15.24,16.51 17.78,17.78 25.4,25.4 38.1,25.4 45.72,26.67 62.23,26.67 64.77,25.4 67.31,25.4 71.12,27.94 74.93,27.94 E3.5
N$32
  Top 0.406: E10.10 53.34,69.85 53.34,60.96 E6.5 50.8,52.07 48.26,52.07 46.99,50.8 46.99,46.99 44.45,44.45 41.91,43.18 38.1,43.18 16.51,44.45 13.97,45.72 8.89,45.72 U$3.AR1
  Bottom 0.406: E7.6 74.93,57.15 73.66,58.42 68.58,58.42 67.31,57.15 67.31,55.88 66.04,54.61 58.42,54.61 E6.4 E6.5
N$33  (via drill 0.81)
  Top 0.406: E6.3 v55.88,66.04 | U$3.BC1 8.89,80.01 15.24,80.01 17.78,77.47 21.59,69.85 v24.13,67.31
  Bottom 0.406: v24.13,67.31 43.18,67.31 50.8,66.04 v55.88,66.04
N$34  (via drill 0.81)
  Top 0.406: U$3.BD1 8.89,83.82 13.97,83.82 17.78,80.01 22.86,71.12 24.13,69.85 v26.67,68.58 | E6.1 v66.04,67.31
  Bottom 0.406: v26.67,68.58 48.26,68.58 52.07,67.31 v66.04,67.31
N$35  (via drill 0.81)
  Top 0.406: E8.5 E12.10 | v72.39,69.85 E11.8 | v31.75,71.12 30.48,72.39 25.4,72.39 22.86,74.93 22.86,81.28 20.32,85.09 15.24,90.17 8.89,90.17 U$3.BF1
  Bottom 0.406: E8.4 E8.5 | v31.75,71.12 33.02,72.39 45.72,72.39 52.07,69.85 63.5,69.85 66.04,71.12 v72.39,69.85 78.74,69.85 81.28,68.58 90.17,68.58 95.25,69.85 99.06,72.39 E12.10
N$36  (via drill 0.81)
  Top 0.406: U$3.BA1 8.89,73.66 16.51,73.66 17.78,71.12 19.05,67.31 19.05,66.04 20.32,64.77 v33.02,63.5
  Bottom 0.406: E8.1 110.49,57.15 107.95,60.96 101.6,63.5 93.98,66.04 83.82,66.04 74.93,63.5 71.12,64.77 69.85,64.77 67.31,63.5 64.77,63.5 62.23,64.77 57.15,62.23 49.53,62.23 45.72,63.5 v33.02,63.5
N$37
  Bottom 0.406: E6.8 52.07,45.72 64.77,45.72 67.31,46.99 68.58,46.99 72.39,50.8 81.28,50.8 82.55,49.53 E7.12
N$38
  Bottom 0.406: E7.2 85.09,57.15 86.36,58.42 91.44,58.42 93.98,55.88 93.98,53.34 95.25,50.8 E8.8
N$39  (via drill 0.81)
  Top 0.406: E10.4 v57.15,86.36 57.15,87.63 E14.10
  Bottom 0.406: E11.6 74.93,83.82 73.66,85.09 71.12,85.09 67.31,83.82 66.04,82.55 66.04,81.28 64.77,80.01 59.69,80.01 E10.4 E10.5 | U$3.BE2 10.16,86.36 27.94,86.36 46.99,87.63 49.53,87.63 52.07,86.36 v57.15,86.36
N$40  (via drill 0.81)
  Top 0.406: E7.9 v76.2,41.91
  Bottom 0.406: U$3.AM2 10.16,35.56 15.24,35.56 21.59,40.64 24.13,41.91 v76.2,41.91
N$41  (via drill 0.81)
  Top 0.406: E7.5 v74.93,66.04 | U$3.BB1 8.89,77.47 13.97,77.47 16.51,76.2 v21.59,67.31
  Bottom 0.406: v21.59,67.31 24.13,64.77 29.21,64.77 33.02,66.04 43.18,66.04 53.34,63.5 55.88,63.5 60.96,66.04 v74.93,66.04
N$42
  Top 0.406: E13.2 43.18,105.41 43.18,81.28 41.91,80.01 31.75,80.01 E9.8
N$43  (via drill 0.81)
  Top 0.406: v25.4,119.38 36.83,118.11 45.72,115.57 49.53,114.3 53.34,111.76 E14.5 46.99,101.6 46.99,80.01 45.72,78.74 33.02,78.74 E9.9
  Bottom 0.406: E15.6 73.66,110.49 58.42,110.49 E14.4 E14.5 | U$3.BS2 11.43,118.11 13.97,118.11 v25.4,119.38
N$44  (via drill 0.81)
  Top 0.406: U$3.BE1 8.89,86.36 15.24,86.36 19.05,82.55 21.59,77.47 21.59,74.93 24.13,71.12 v29.21,69.85 | E11.9 v77.47,67.31
  Bottom 0.406: v29.21,69.85 33.02,69.85 36.83,71.12 44.45,71.12 52.07,68.58 63.5,68.58 66.04,69.85 71.12,67.31 v77.47,67.31
N$46  (via drill 0.81)
  Top 0.406: v71.12,92.71 E11.5
  Bottom 0.406: U$3.BJ2 10.16,96.52 13.97,96.52 25.4,92.71 58.42,92.71 62.23,91.44 67.31,91.44 v71.12,92.71
N$47  (via drill 0.81)
  Top 0.406: E12.5 E16.10 | E15.8 v72.39,95.25
  Bottom 0.406: E12.4 E12.5 | U$3.BM2 10.16,105.41 13.97,105.41 26.67,97.79 45.72,97.79 49.53,96.52 68.58,96.52 v72.39,95.25 76.2,93.98 86.36,93.98 93.98,95.25 97.79,96.52 100.33,100.33 E16.10
N$48  (via drill 0.81)
  Top 0.406: v69.85,105.41 E15.9
  Bottom 0.406: U$3.BN2 10.16,109.22 13.97,109.22 17.78,106.68 24.13,104.14 43.18,104.14 45.72,105.41 46.99,106.68 49.53,106.68 52.07,105.41 v69.85,105.41
N$50  (via drill 0.81)
  Top 0.406: E15.5 v74.93,123.19
  Bottom 0.406: U$3.BT2 10.16,121.92 27.94,121.92 60.96,124.46 v74.93,123.19
N$51
  Top 0.406: U$3.BR1 10.16,115.57 13.97,115.57 15.24,114.3 20.32,107.95 22.86,106.68 26.67,106.68 E13.6
  Bottom 0.406: E13.6 29.21,107.95 30.48,106.68 41.91,106.68 44.45,109.22 44.45,110.49 46.99,111.76 52.07,113.03 62.23,114.3 93.98,114.3 97.79,111.76 E16.5 E16.4
N$52  (via drill 0.81)
  Top 0.406: U$3.BS1 8.89,118.11 15.24,118.11 19.05,114.3 v21.59,110.49
  Bottom 0.406: E13.5 29.21,111.76 25.4,111.76 v21.59,110.49
N$53
  Bottom 0.406: U$3.AR2 10.16,45.72 15.24,45.72 19.05,46.99 26.67,52.07 38.1,52.07 E5.1
N$54
  Bottom 0.406: E5.2 36.83,53.34 26.67,53.34 22.86,50.8 17.78,48.26 10.16,48.26 U$3.AS2
N$55  (via drill 0.81)
  Top 0.406: U$3.AV1 10.16,58.42 13.97,58.42 15.24,57.15 20.32,57.15 21.59,58.42 v21.59,62.23
  Bottom 0.406: E5.3 35.56,58.42 33.02,60.96 29.21,63.5 24.13,63.5 v21.59,62.23
N$56
  Top 0.406: U$3.AS1 8.89,48.26 13.97,48.26 24.13,45.72 36.83,45.72 E5.13
N$57
  Bottom 0.406: U$3.AV2 10.16,58.42 20.32,58.42 25.4,62.23 27.94,62.23 31.75,59.69 E5.4
N$58
  Bottom 0.406: E5.5 30.48,58.42 27.94,60.96 25.4,60.96 20.32,55.88 17.78,54.61 8.89,54.61 U$3.AU2
N$59
  Bottom 0.406: E5.6 29.21,57.15 27.94,58.42 25.4,58.42 22.86,55.88 19.05,53.34 16.51,52.07 8.89,52.07 U$3.AT2
N$60
  Top 0.406: U$3.AU1 10.16,54.61 20.32,54.61 25.4,50.8 E5.8
N$61
  Top 0.406: E9.11 35.56,67.31 35.56,62.23 33.02,59.69 25.4,59.69 24.13,58.42 24.13,54.61 E5.10 E5.11
N$62
  Top 0.406: E9.12 38.1,66.04 39.37,62.23 41.91,59.69 45.72,58.42 46.99,57.15 46.99,53.34 45.72,52.07 40.64,52.07 E5.12
  Bottom 0.406: E5.9 29.21,49.53 30.48,50.8 35.56,50.8 36.83,49.53 E5.12
N$63
  Bottom 0.406: E10.8 50.8,73.66 53.34,72.39 62.23,72.39 66.04,73.66 81.28,73.66 E11.12
N$64
  Bottom 0.406: E11.2 85.09,83.82 86.36,85.09 91.44,85.09 93.98,82.55 93.98,78.74 E12.8
N$65  (via drill 0.81)
  Top 0.406: E10.1 66.04,88.9 v66.04,93.98
  Bottom 0.406: U$3.BL2 8.89,102.87 13.97,102.87 15.24,101.6 25.4,96.52 45.72,96.52 49.53,95.25 64.77,95.25 v66.04,93.98
N$66  (via drill 0.81)
  Top 0.406: E10.3 v62.23,92.71
  Bottom 0.406: U$3.BK2 10.16,99.06 13.97,99.06 25.4,95.25 48.26,93.98 60.96,93.98 v62.23,92.71
N$67
  Bottom 0.406: E12.1 109.22,86.36 106.68,90.17 101.6,92.71 85.09,92.71 81.28,91.44 74.93,91.44 66.04,88.9 63.5,88.9 58.42,91.44 22.86,91.44 13.97,92.71 8.89,92.71 U$3.BH2
N$68
  Bottom 0.406: E12.2 107.95,83.82 106.68,86.36 104.14,88.9 96.52,91.44 88.9,91.44 81.28,90.17 74.93,90.17 66.04,87.63 63.5,87.63 58.42,90.17 52.07,90.17 43.18,88.9 15.24,88.9 13.97,90.17 8.89,90.17 U$3.BF2
N$70
  Top 0.406: U$3.BJ1 8.89,96.52 13.97,96.52 E9.6
N$72
  Bottom 0.406: E15.12 80.01,99.06 50.8,99.06 49.53,100.33 E14.8
N$73
  Bottom 0.406: E15.2 86.36,110.49 92.71,110.49 93.98,109.22 93.98,105.41 E16.8
N$74
  Top 0.406: E14.3 55.88,115.57 50.8,119.38 45.72,120.65 15.24,124.46 8.89,124.46 U$3.BU1
N$75
  Top 0.406: U$3.BV1 10.16,128.27 13.97,128.27 19.05,127 53.34,124.46 59.69,123.19 63.5,120.65 64.77,118.11 E14.1
N$76
  Bottom 0.406: U$3.BV2 10.16,128.27 17.78,128.27 97.79,129.54 102.87,127 106.68,121.92 109.22,114.3 E16.1
N$77
  Bottom 0.406: U$3.BU2 12.7,124.46 20.32,124.46 45.72,125.73 80.01,125.73 95.25,120.65 100.33,120.65 104.14,116.84 106.68,113.03 E16.2
N$79
  Top 0.406: U$3.BK1 8.89,99.06 15.24,99.06 E9.5
N$80
  Top 0.406: E9.3 34.29,86.36 13.97,105.41 8.89,105.41 U$3.BM1
N$81
  Top 0.406: U$3.BN1 8.89,109.22 13.97,109.22 25.4,97.79 E9.1
VCC
  Top 0.813: C4.1 116.84,29.21 116.84,50.8 | 116.84,50.8 116.84,77.47 | 116.84,77.47 116.84,97.79 C16.1 | C12.1 116.84,77.47 | C8.1 116.84,50.8 | C7.1 92.71,50.8 107.95,50.8 E8.14 | C11.1 92.71,77.47 107.95,77.47 E12.14 | C15.1 92.71,104.14 107.95,104.14 E16.14 | C5.1 E5.14 | E4.14 107.95,25.4 95.25,25.4 C3.1
  Bottom 0.813: U$3.AA2 11.43,3.81 19.05,3.81 C17.+ 31.75,5.08 C18.1 34.29,10.16 34.29,12.7 35.56,13.97 R1.2 45.72,12.7 83.82,5.08 101.6,5.08 106.68,10.16 109.22,17.78 E4.14 C4.1 | E2.14 C2.1 71.12,26.67 85.09,26.67 87.63,24.13 E3.14 C3.1 | E1.14 C1.1 | C7.1 E7.14 87.63,49.53 85.09,52.07 71.12,52.07 C6.1 E6.14 64.77,49.53 63.5,50.8 54.61,50.8 53.34,52.07 48.26,52.07 C5.1 | E8.14 C8.1 | C12.1 E12.14 | U$3.BA2 10.16,73.66 13.97,73.66 25.4,77.47 40.64,77.47 41.91,76.2 E9.14 C9.1 48.26,78.74 50.8,78.74 57.15,77.47 62.23,77.47 E10.14 C10.1 71.12,77.47 85.09,77.47 E11.14 C11.1 | C15.1 E15.14 85.09,104.14 72.39,104.14 C14.1 E14.14 64.77,102.87 63.5,104.14 52.07,104.14 49.53,105.41 48.26,105.41 C13.1 E13.14 | E16.14 C16.1
  Bottom 1.016: C1.1 48.26,25.4 62.23,25.4 64.77,24.13 E2.14

### Text on the board
Top: FLIP CHIP
Bottom: MQ REGISTER | M218A